# EAGLE design Adafruit 1.54inch 240x240 rev E (EAGLE 6.4)
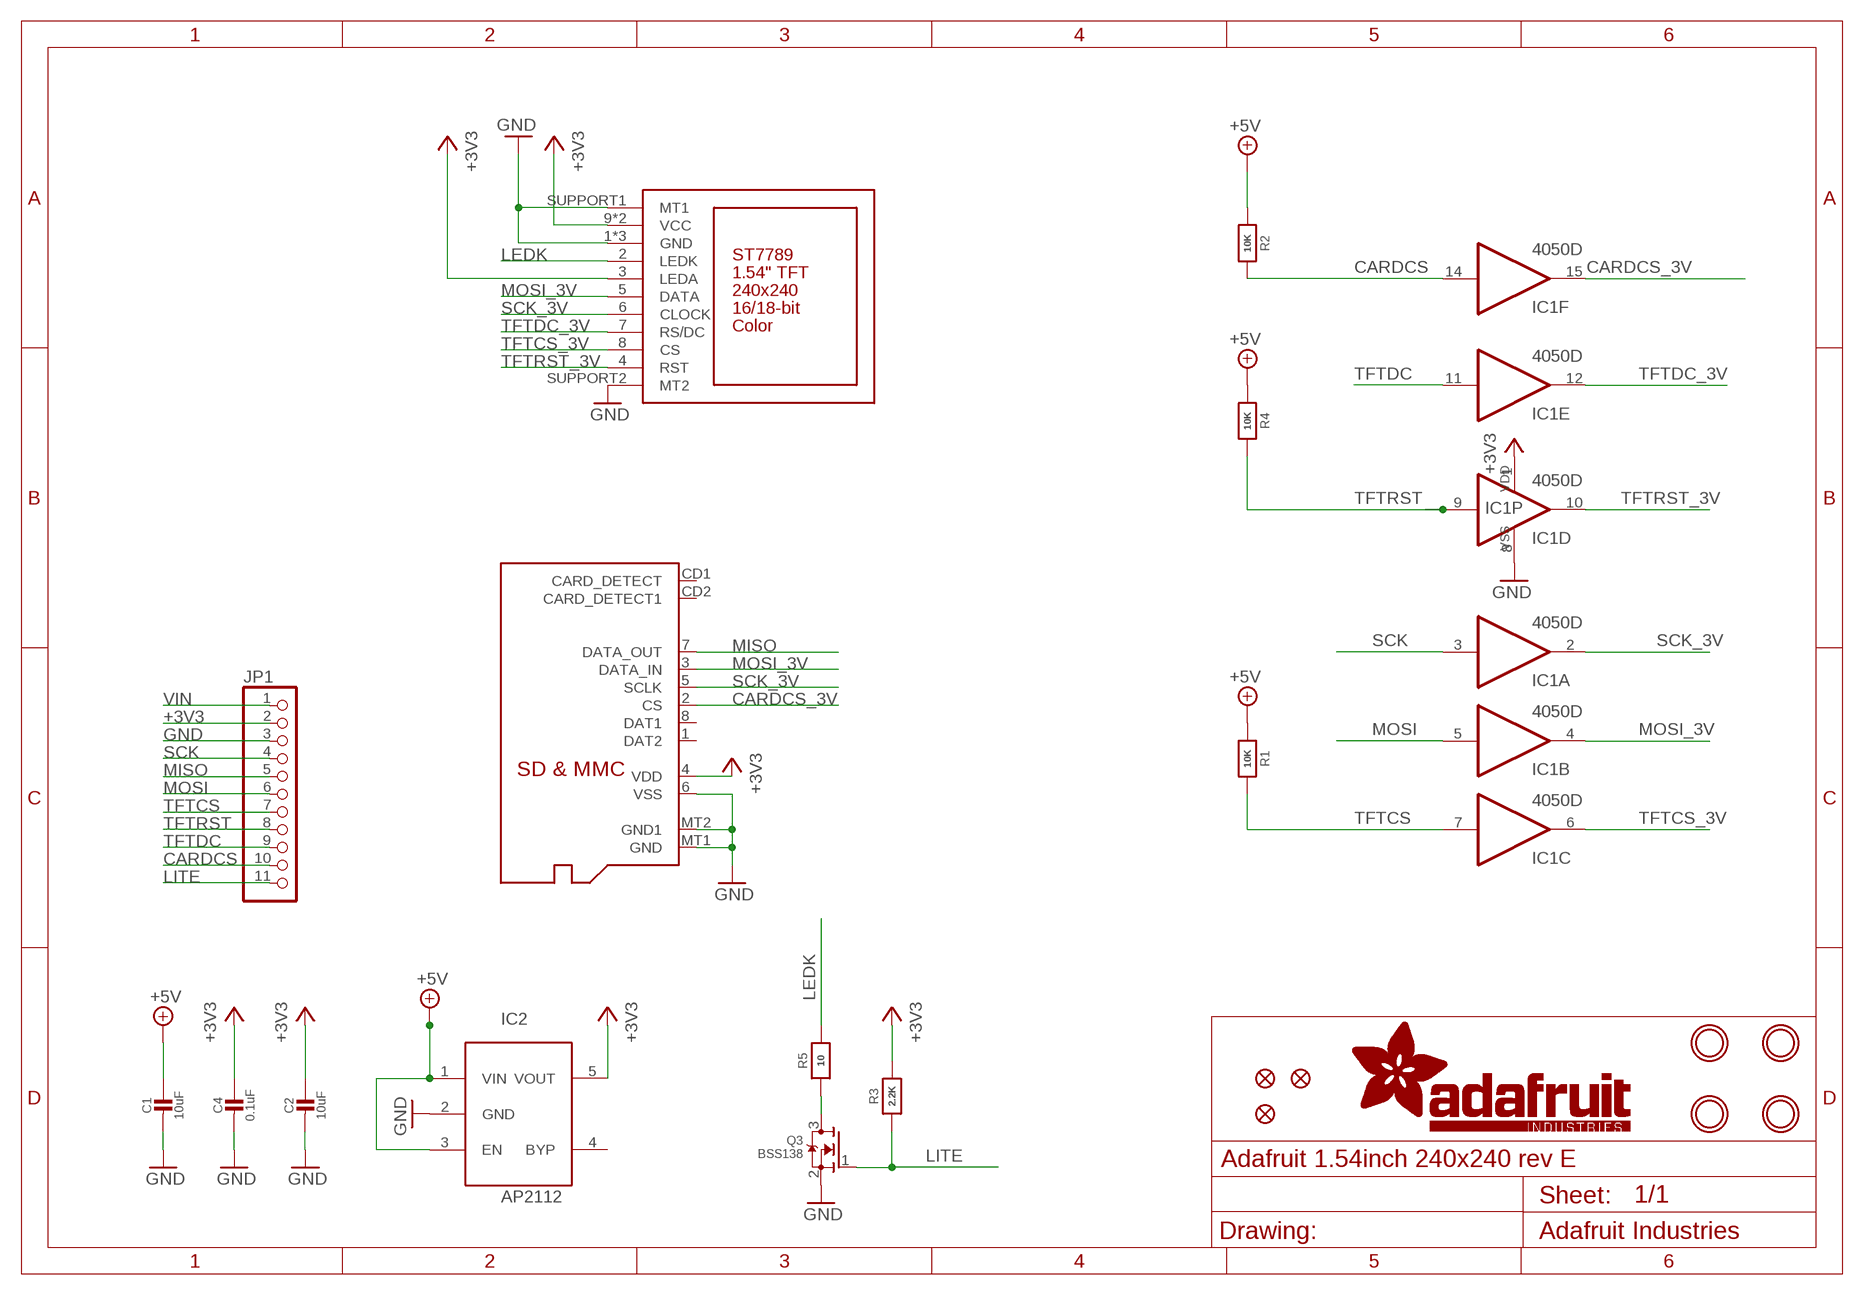
[diagram p0: schematic, sheet 1]

## Parts
C1  10uF  CAP_CERAMIC0805-NOOUTLINE  [0805-NO]
C2  10uF  CAP_CERAMIC0805-NOOUTLINE  [0805-NO]
C4  0.1uF  CAP_CERAMIC0805-NOOUTLINE  [0805-NO]
DISP1  DISP_LCD_ST7789_1.54IN  [TFT_1.54IN_240X240]
IC1  4050D  [SO16]
IC2  AP2112  LP298XS  [SOT23-5L]
JP1  HEADER-1X1176MIL  [1X11_ROUND_76]
Q2  MICROSD  [MICROSD]
Q3  BSS138  MOSFET-NWIDE  [SOT23-WIDE]
R1  10K  RESISTOR0805_NOOUTLINE  [0805-NO]
R2  10K  RESISTOR0805_NOOUTLINE  [0805-NO]
R3  2.2K  RESISTOR0805_NOOUTLINE  [0805-NO]
R4  10K  RESISTOR0805_NOOUTLINE  [0805-NO]
R5  10  RESISTOR0805_NOOUTLINE  [0805-NO]
U$3  FIDUCIAL_1MM  [FIDUCIAL_1MM]
U$4  FIDUCIAL_1MM  [FIDUCIAL_1MM]
U$5  FIDUCIAL_1MM  [FIDUCIAL_1MM]
U$7  MOUNTINGHOLE2.5  [MOUNTINGHOLE_2.5_PLATED]
U$8  MOUNTINGHOLE2.5  [MOUNTINGHOLE_2.5_PLATED]
U$9  MOUNTINGHOLE2.5  [MOUNTINGHOLE_2.5_PLATED]
U$10  MOUNTINGHOLE2.5  [MOUNTINGHOLE_2.5_PLATED]

## Nets
+3V3 [power]: C2.1 C4.1 DISP1.3(LEDA) DISP1.9(VCC) DISP1.10(VCC) IC1.1(P:VDD) IC2.5(VOUT) JP1.2 Q2.4(VDD) R3.2
CARDCS: IC1.14(F:I) JP1.10 R2.1
CARDCS_3V: IC1.15(F:O) Q2.2(CS)
GND: C1.2 C2.2 C4.2 DISP1.1(GND) DISP1.11(GND) DISP1.12(GND) DISP1.SUPPORT1(MT1) DISP1.SUPPORT2(MT2) IC1.8(P:VSS) IC2.2(GND) JP1.3 Q2.6(VSS) Q2.MT1(GND) Q2.MT2(GND1) Q3.2(S)
LEDK: DISP1.2(LEDK) R5.2
LITE: JP1.11 Q3.1(G) R3.1
MISO: JP1.5 Q2.7(DATA_OUT)
MOSI: IC1.5(B:I) JP1.6
MOSI_3V: DISP1.5(DATA) IC1.4(B:O) Q2.3(DATA_IN)
N$1: Q3.3(D) R5.1
SCK: IC1.3(A:I) JP1.4
SCK_3V: DISP1.6(CLOCK) IC1.2(A:O) Q2.5(SCLK)
TFTCS: IC1.7(C:I) JP1.7 R1.1
TFTCS_3V: DISP1.8(CS) IC1.6(C:O)
TFTDC: IC1.11(E:I) JP1.9
TFTDC_3V: DISP1.7(RS/DC) IC1.12(E:O)
TFTRST: IC1.9(D:I) JP1.8 R4.1
TFTRST_3V: DISP1.4(RST) IC1.10(D:O)
VIN [power]: C1.1 IC2.1(VIN) IC2.3(EN) JP1.1 R1.2 R2.2 R4.2 ; supply symbol labelled +5V
Unconnected: IC2.4(BYP) Q2.1(DAT2) Q2.8(DAT1) Q2.CD1(CARD_DETECT) Q2.CD2(CARD_DETECT1)

## Library data of the parts
C1 C2 C4 = microbuilder:CAP_CERAMIC: Ceramic Capacitors For new designs, use the packages preceded by an '_' character since they are more reliable: The following footprints should be used on most boards: _0402 - Standard footprint for regular board layouts _0603 - Standard footprint for regular board layouts _0805 - Standard footprint for regular board layouts _1206 - Standard footprint for regular board layouts For extremely tight-pitch boards where space is at a premium, the following 'micro-pitch' footprints can be used (smaller pads, no silkscreen outline, etc.): _0402MP - Micro-pitch footprint for very dense/compact boards _0603MP - Micro-pitch footprint for very dense/compact boards _0805MP - Micro-pitch footprint for very dense/compact boards _1206MP - Micro-pitch footprint for very dense/compact boards
DISP1 = microbuilder:DISP_LCD_ST7789_1.54IN
IC1 = 40xx:4050: Hex non-inverting BUFFER
IC2 = adafruit:LP298X
JP1 = microbuilder:HEADER-1X11
Q2 = adafruit:MICROSD: Micro-SD / Transflash card holder with SPI pinout For the 3M # 2908-05WB-MG and/or 4UCON #19656 push-push type
Q3 = microbuilder:MOSFET-N: N-Channel Mosfet LEGEND VDS: Voltage Drain-Source ID: Drain Current RDS(ON): Drain-Source On-State Resistance VGS(TH): Gate-Source Threshold Voltage CISS: Drain-Source Input Capacitance SOT-23 Name VDS ID RDS(ON) VGS(TH) CISS Order Number 2N7002E 60V 260mA 2.5 Ohm 2.5V @ 250uA 26.7pF @ 25V 2N7002ET1GOSTR-ND BSH103 30V 850mA 400 mOhm 400mV @ 1mA 83pF @ 24V BSH103,235-ND BSS138 60V 320mA 1.6 Ohm 1.5V @ 250uA 50pF @ 10V Mouser: 771-BSS138PW115 DMN2075U-7 20V 4.2A 38 mOhm 1V @ 250 uA 594.3pF @ 10V DMN2075U-7DICT-ND * BSS138 good choice for I2C level-shifting POWERPAK 1212-8 Name VDS ID RDS(ON) VGS(TH) CISS Order Number Si7308DN 60V 6A 58 mOhm 3V @ 250uA 665pF @ 15V SI7308DN-T1-E3CT-ND
R1-R5 = microbuilder:RESISTOR: Resistors For new designs, use the packages preceded by an '_' character since they are more reliable: The following footprints should be used on most boards: _0402 - Standard footprint for regular board layouts _0603 - Standard footprint for regular board layouts _0805 - Standard footprint for regular board layouts _1206 - Standard footprint for regular board layouts For extremely tight-pitch boards where space is at a premium, the following 'micro-pitch' footprints can be used (smaller pads, no silkscreen outline, etc.): _0402MP - Micro-pitch footprint for very dense/compact boards _0603MP - Micro-pitch footprint for very dense/compact boards _0805MP - Micro-pitch footprint for very dense/compact boards _1206MP - Micro-pitch footprint for very dense/compact boards
U$3-U$5 = microbuilder:FIDUCIAL: Fiducial Alignment Points Various fiducial points for machine vision alignment.; BOM: EXCLUDE
U$7-U$10 = microbuilder:MOUNTINGHOLE: Mounting Hole For #2 screws (0.086"/2.18mm width, 0.094"/2.4mm hole) use 2.5mm; BOM: EXCLUDE

## Net classes
1 power: width 0.254 mm

## Board
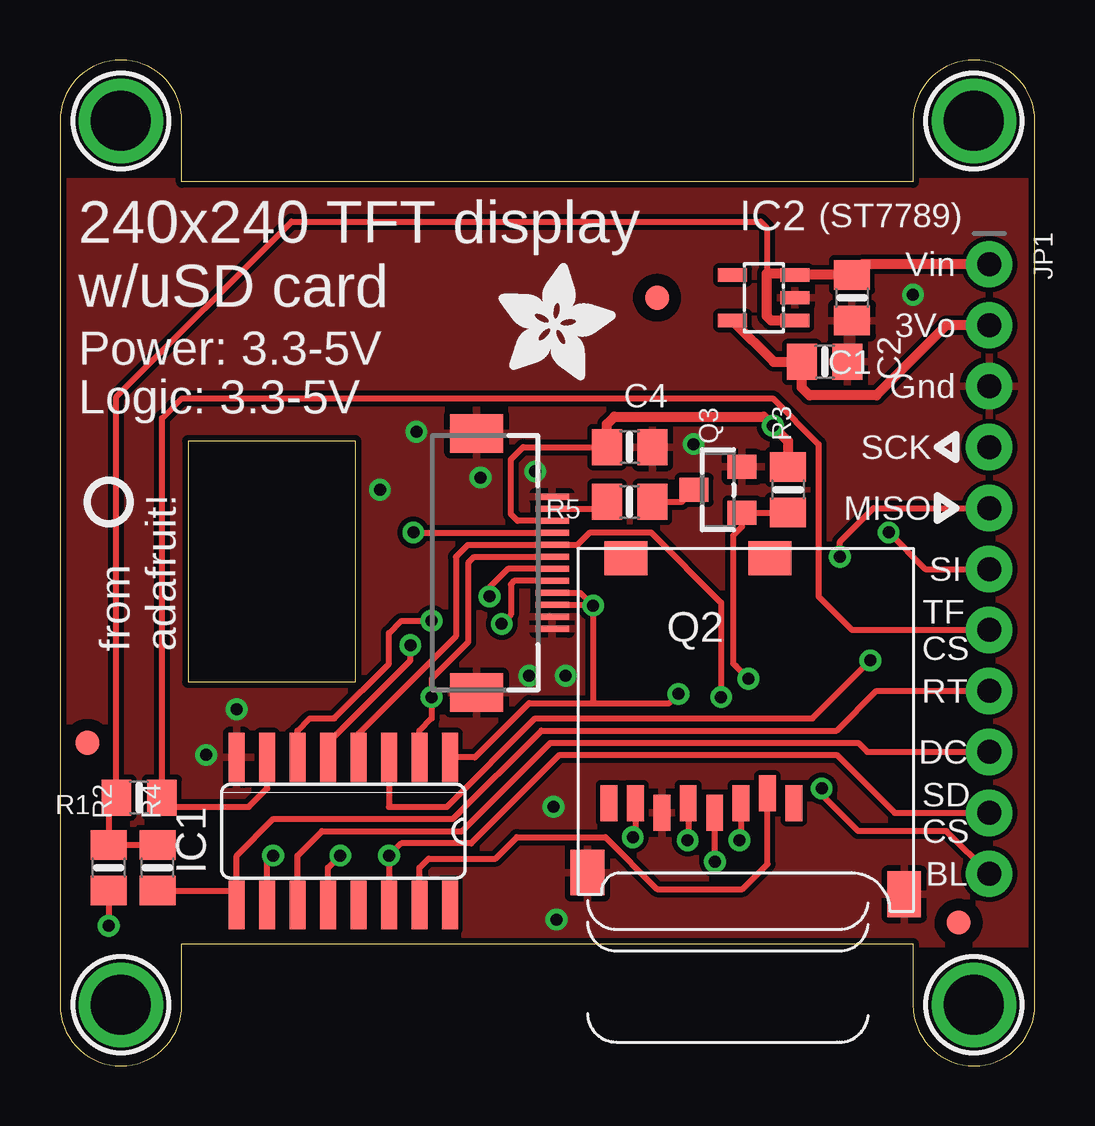
[diagram p1: board, top side]
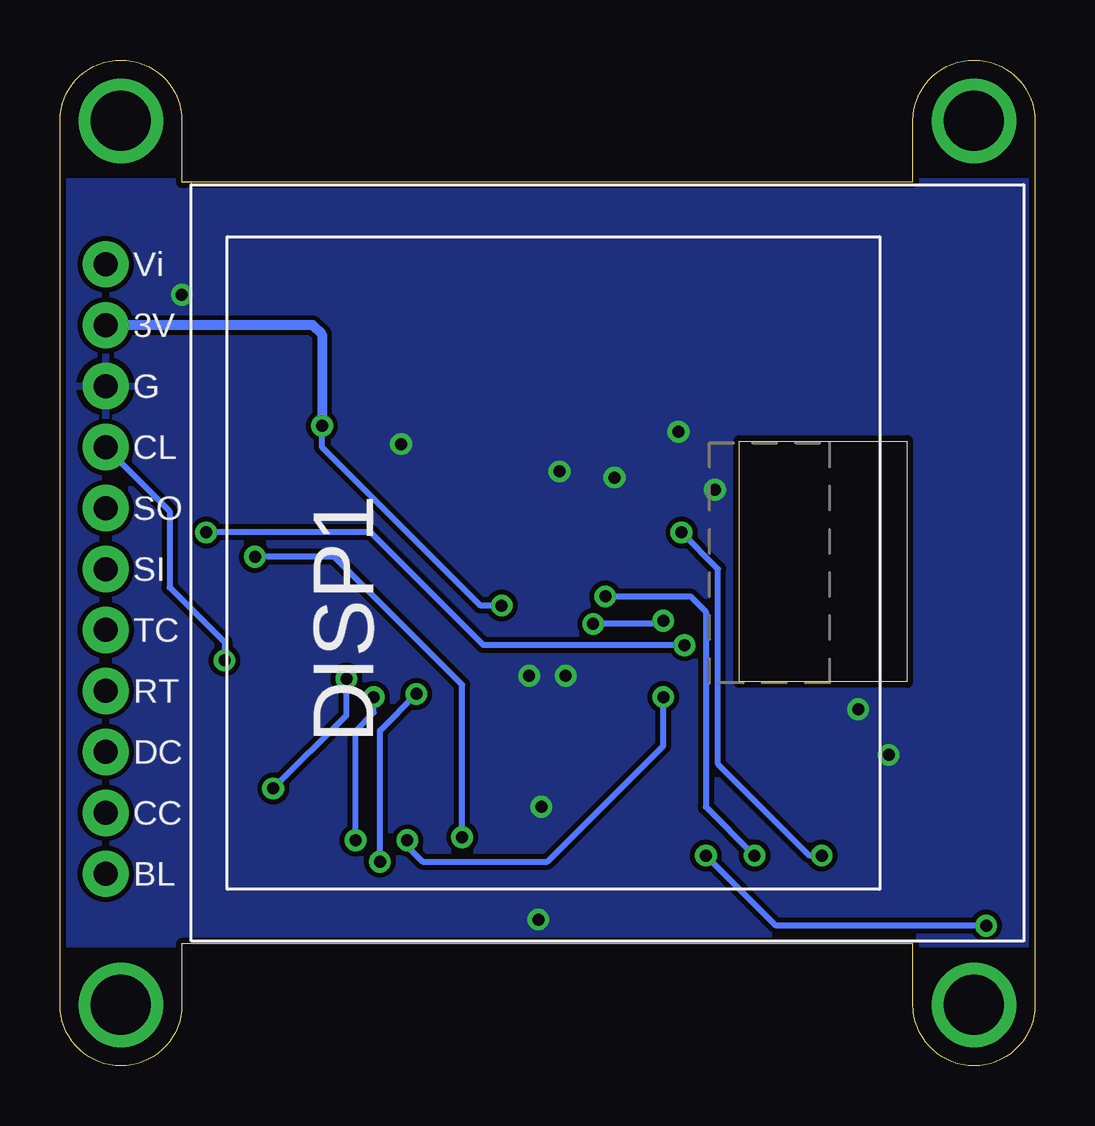
[diagram p2: board, bottom side, seen from below]

Size 40.64 x 41.91 mm. Coordinates in mm from the lower left corner, seen from the top.
Outline: 35.56,5.08 35.56,2.54 arc90 38.1,0 arc90 40.64,2.54 40.64,39.37 arc90 38.1,41.91 arc90 35.56,39.37 35.56,36.83 5.08,36.83 5.08,39.37 arc90 2.54,41.91 arc90 0,39.37 0,2.54 arc90 2.54,0 arc90 5.08,2.54 5.08,5.08 35.56,5.08
Outline: 5.33,26.03 5.33,16 12.32,16 12.32,26.03 5.33,26.03
Copper layers (1*16): Top 0.035mm / dielectric 1.5mm / Bottom 0.035mm
Design rules "adafruit *": minimum track width 8mil, minimum drill 15.5mil, track to track 8mil, track to pad 8mil, pad to pad 8mil, via to via 8mil, smd to smd 8mil, copper to edge 10mil, drill to drill 8mil, minimum pad ring 10mil, minimum via ring 8mil, stop-mask expansion 2mil, vias tented up to drill 20mil, thermal gap 10mil

### Footprints (pad centres in the part's own frame; a part is rotated, then mirrored left to right if it is on the bottom)
0805-NO = smd 1.24 x 1.5: 1 -0.95,0; 2 0.95,0
TFT_1.54IN_240X240 = smd 0.25 x 1.4 bottom: 1 2.75,0.452; 2 2.25,0.452; 3 1.75,0.452; 4 1.25,0.452; 5 0.75,0.452; 6 0.25,0.452; 7 -0.25,0.452; 8 -0.75,0.452; 9 -1.25,0.452; 10 -1.75,0.452; 11 -2.25,0.452; 12 -2.75,0.452 | smd 1.6 x 2.2 bottom: SUPPORT1 5.4,-2.698; SUPPORT2 -5.4,-2.698
SO16 = smd 0.66 x 2.032: 1 -4.445,-3.073; 2 -3.175,-3.073; 3 -1.905,-3.073; 4 -0.635,-3.073; 5 0.635,-3.073; 6 1.905,-3.073; 7 3.175,-3.073; 8 4.445,-3.073; 9 4.445,3.073; 10 3.175,3.073; 11 1.905,3.073; 12 0.635,3.073; 13 -0.635,3.073; 14 -1.905,3.073; 15 -3.175,3.073; 16 -4.445,3.073
SOT23-5L = smd 0.55 x 1.2: 1 -0.95,-1.3; 2 0,-1.3; 3 0.95,-1.3; 4 0.95,1.3; 5 -0.95,1.3
1X11_ROUND_76 = drill 1 pad 1.93: 1 -12.7,0; 2 -10.16,0; 3 -7.62,0; 4 -5.08,0; 5 -2.54,0; 6 0,0; 7 2.54,0; 8 5.08,0; 9 7.62,0; 10 10.16,0; 11 12.7,0
MICROSD = smd 0.7 x 1.5: 1 9,-10.64; 2 7.9,-10.24; 3 6.8,-10.64; 4 5.7,-11.04; 5 4.6,-10.64; 6 3.5,-11.04; 7 2.4,-10.64; 8 1.3,-10.64 | smd 1.8 x 1.4: CD1 2,-0.44; CD2 8,-0.44 | smd 1.4 x 1.9: MT1 0.4,-13.54; MT2 13.6,-14.44
SOT23-WIDE = smd 1 x 1.2: 1 -0.95,-1; 2 0.95,-1; 3 0,1
FIDUCIAL_1MM = smd 1 x 1: 1 0,0
MOUNTINGHOLE_2.5_PLATED = drill 2.5 pad 3.2: P$1 0,0

### Placement (x,y rotation side)
C1  33.02,32 270 top
C2  31.88,29.34 0 top
C4  23.75,25.78 0 top
DISP1  20.07,20.95 90 bottom
IC1  11.81,9.78 180 top
IC2  29.34,32 90 top
JP1  38.73,20.7 270 top
Q2  21.59,21.59 0 top
Q3  27.43,24 90 top
R1  3.3,11.18 180 top
R2  2.03,8.25 90 top
R3  30.35,24 90 top
R4  4.06,8.25 90 top
R5  23.75,23.49 180 top
U$1  [ADAFRUIT_5MM]  18.29,28.58 0 top
U$2  [PCBFEAT-REV-040]  2.03,23.49 90 top
U$3  37.47,5.97 0 top
U$4  1.14,13.46 0 top
U$5  24.89,32 0 top
U$7  2.54,39.37 0 top
U$8  2.54,2.54 0 top
U$9  38.1,39.37 0 top
U$10  38.1,2.54 0 top

### Tracks (layer width: path | path; a pad name or v marks a point on that pad's centre or on a via)
+3V3  (via drill 0.5)
  Top 0.254: 22.23,15.11 19.56,15.11 17.3,12.85 IC1.1 | 22.23,15.11 25.4,15.11 v25.78,15.49 | DISP1.3 19.08,22.7 18.8,22.99 18.8,25.27 19.3,25.78 C4.1 | v22.23,19.18 22.23,15.11 | Q2.4 27.29,8.52 v27.3,8.51 | DISP1.9 21.7,19.7 v22.23,19.18 | DISP1.10 22.2,19.2 v22.23,19.18
  Top 0.406: JP1.2 36.96,30.86 34.04,27.94 31.24,27.94 30.93,28.26 C2.1 29.75,29.34 IC2.5 | R3.2 30.35,26.03 v29.72,26.67 29.34,27.05 23.11,27.05 22.8,26.74 C4.1
  Bottom 0.254: v27.3,8.51 27.3,13.97 v25.78,15.49 | v22.23,19.18 23.11,19.18 29.72,25.78 v29.72,26.67
  Bottom 0.406: JP1.2 30.1,30.86 29.72,30.48 v29.72,26.67
CARDCS  (via drill 0.5)
  Top 0.254: IC1.14 v13.72,8.76 14.22,9.27 17.14,9.27 20.83,12.95 32.38,12.95 34.8,10.54 JP1.10 | R2.1 v2.03,5.84
  Bottom 0.254: v2.03,5.84 10.79,5.84 v13.72,8.76
CARDCS_3V
  Top 0.254: IC1.15 14.99,8.25 15.37,8.64 18.16,8.64 19.05,9.53 22.73,9.53 24.89,7.37 28.45,7.37 29.49,8.41 Q2.2
GND  (via drill 0.5)
  other vias: 20.7,6.1 19.56,16.26 19.81,24.77 35.56,32.13 13.34,24 26.42,25.91 20.57,10.79 6.1,12.95 7.37,14.86 14.86,26.42 17.53,24.51 21.08,16.26
  pour Top: 0,5.08 0,36.83 40.64,36.83 40.64,5.08
  pour Bottom: 0,5.08 0,36.83 40.64,36.83 40.64,5.08
LEDK
  Top 0.254: DISP1.2 22.51,23.2 R5.2
LITE  (via drill 0.5)
  Top 0.254: v28.7,16.13 28.19,16.64 28.18,16.65 28.07,16.76 28.07,22.1 28.43,22.46 Q3.1 R3.1 | JP1.11 36.96,9.78 33.27,9.78 31.75,11.3 v31.75,11.56
  Bottom 0.254: v31.75,11.56 28.7,14.61 v28.7,16.13
MISO  (via drill 0.5)
  Top 0.254: v32.51,21.21 32.51,21.84 33.91,23.24 JP1.5 | Q2.7 23.99,9.64 v23.88,9.53
  Bottom 0.254: v23.88,9.53 23.88,15.88 29.21,21.21 v32.51,21.21
MOSI  (via drill 0.5)
  Top 0.254: v34.54,22.23 36.07,20.7 JP1.6 | IC1.5 11.18,13.46 14.61,16.89 v14.61,17.53
  Bottom 0.254: v14.61,17.53 22.99,17.53 27.69,22.23 v34.54,22.23
MOSI_3V  (via drill 0.5)
  Top 0.254: v27.56,15.37 27.56,19.3 24.64,22.23 22.1,22.23 21.58,21.7 DISP1.5 17.01,21.7 16.51,21.21 16.51,17.91 12.45,13.84 IC1.4 | Q2.3 28.39,9.47 v28.32,9.4
  Bottom 0.254: v28.32,9.4 28.32,13.97 27.56,14.73 v27.56,15.37
N$1
  Top 0.254: R5.1 25.92,23.49 Q3.3
SCK  (via drill 0.5)
  Top 0.254: IC1.3 13.72,10.79 16.13,10.79 19.81,14.48 31.37,14.48 v33.78,16.89
  Bottom 0.254: JP1.4 36.07,23.11 36.07,19.94 33.78,17.65 v33.78,16.89
SCK_3V  (via drill 0.5)
  Top 0.254: IC1.2 14.99,13.97 15.49,14.48 v15.49,15.37 15.49,16.13 17.02,17.65 17.02,20.95 17.27,21.2 DISP1.6 | Q2.5 26.19,9.43 v26.16,9.4
  Bottom 0.254: v26.16,9.4 26.16,9.14 25.53,8.51 20.32,8.51 15.49,13.34 v15.49,15.37
TFTCS
  Top 0.254: IC1.7 8.64,11.56 7.87,10.79 4.63,10.79 R1.1 4.25,26.98 5.08,27.81 29.72,27.81 31.62,25.91 31.62,19.56 33.02,18.16 JP1.7
TFTCS_3V  (via drill 0.5)
  Top 0.254: IC1.6 9.91,13.97 10.41,14.48 11.43,14.48 13.72,16.76 13.72,18.03 14.22,18.54 v15.49,18.54 | DISP1.8 18.93,20.2 18.8,20.07 18.8,18.8 v18.41,18.41
  Bottom 0.254: v15.49,18.54 15.62,18.41 v18.41,18.41
TFTDC
  Top 0.254: IC1.11 9.91,8.76 10.92,9.78 16.76,9.78 20.45,13.46 33.27,13.46 33.66,13.08 JP1.9
TFTDC_3V  (via drill 0.5)
  Top 0.254: IC1.12 11.18,8.25 v11.68,8.76 | DISP1.7 18.67,20.7 17.91,19.94 v17.91,19.56
  Bottom 0.254: 11.43,8.76 v11.68,8.76 13.72,10.79 13.72,18.92 14.35,19.56 v17.91,19.56
TFTRST
  Top 0.254: JP1.8 34.04,15.62 32.38,13.97 20.07,13.97 16.38,10.29 8.89,10.29 7.37,8.76 IC1.9 7.37,7.3 R4.1
TFTRST_3V  (via drill 0.5)
  Top 0.254: IC1.10 8.64,8.51 v8.89,8.76 | v14.73,22.23 14.75,22.2 DISP1.4
  Bottom 0.254: v8.89,8.76 9.4,8.76 13.21,12.57 13.21,20.7 v14.73,22.23
VIN
  Top 0.254: 29.46,33.02 29.46,34.92 29.21,35.18 9.65,35.18 2.35,27.88 R1.2 2.03,10.86 R2.2 R4.2
  Top 0.406: JP1.1 33.46,33.4 C1.1 IC2.3 30.57,33.02 29.46,33.02 29.46,31.24 29.65,31.05 IC2.1

### Text on the board
tPlace: (ST7789) | 240x240 TFT display | Vin | w/uSD card | 3Vo | Power: 3.3-5V | Gnd | Logic: 3.3-5V | SCK | MISO | SI | TF / CS | from / adafruit! | RT | DC | SD / CS | BL
bPlace: Vi | 3V | G | CL | SO | SI | TC | RT | DC | CC | BL